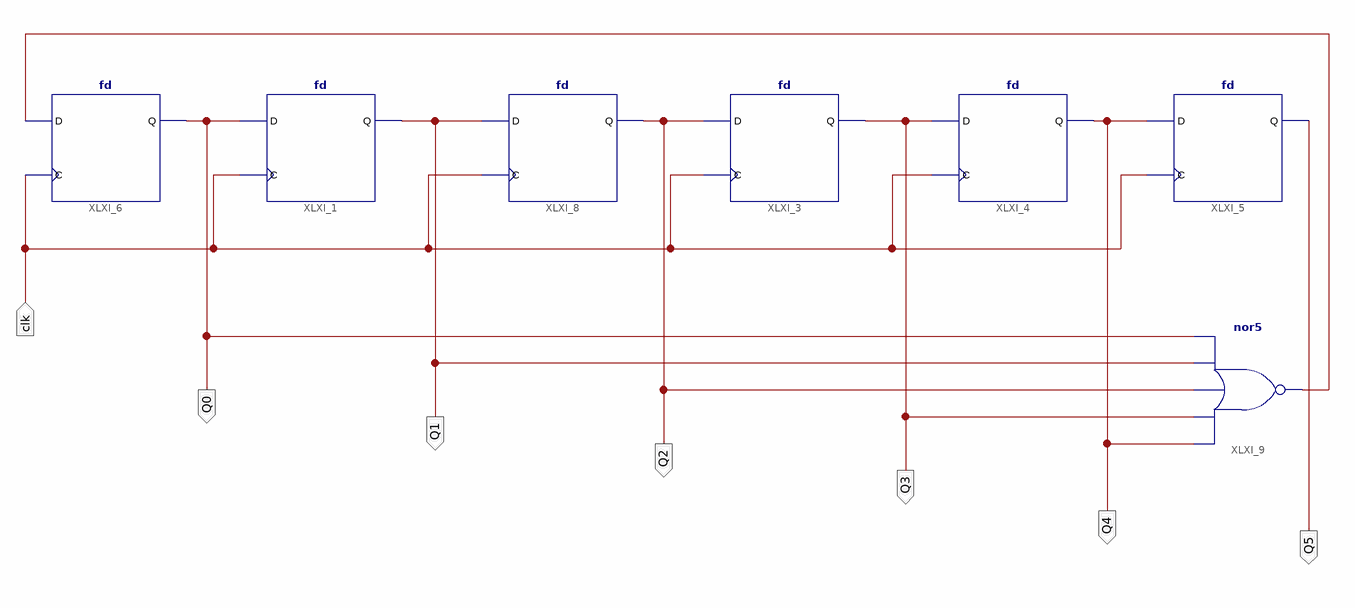
[diagram p0: schematic sheet 1]
// Xilinx ISE schematic koder1zN.sch (spartan3e) as structural Verilog: 7 symbols, 7 ports
module koder1zN (
  input  clk,
  output Q0,
  output Q1,
  output Q2,
  output Q3,
  output Q4,
  output Q5
);

  wire XLXN_15;

  fd XLXI_1 (.C(clk), .D(Q0), .Q(Q1));
  fd XLXI_3 (.C(clk), .D(Q2), .Q(Q3));
  fd XLXI_4 (.C(clk), .D(Q3), .Q(Q4));
  fd XLXI_5 (.C(clk), .D(Q4), .Q(Q5));
  fd XLXI_6 (.C(clk), .D(XLXN_15), .Q(Q0));
  fd XLXI_8 (.C(clk), .D(Q1), .Q(Q2));
  nor XLXI_9 (XLXN_15, Q4, Q3, Q2, Q1, Q0);
endmodule
